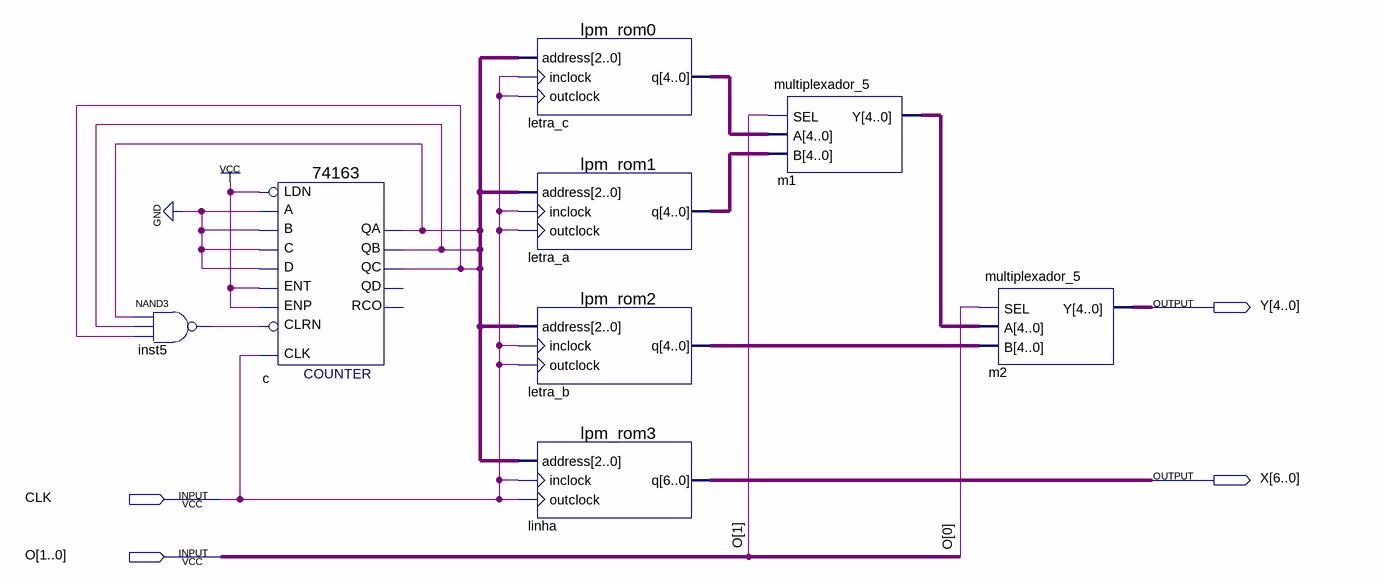
[diagram p0: schematic sheet]
// Quartus schematic matriz.bdf as structural Verilog: 8 symbols, 4 pins
module matriz (
  input  CLK,
  input  [1:0] O,
  output [4:0] Y,
  output [6:0] X
);

  wire inst5_out;
  wire [2:0] A;
  wire [4:0] letra_a_q, letra_b_q, letra_c_q, m1_y;

  nand inst5 (inst5_out, A[0], A[1], A[2]);
  \74163  c (
    .C(1'b0), .B(1'b0), .A(1'b0), .ENT(1'b1), .D(1'b0), .CLRN(inst5_out), .CLK(CLK), .ENP(1'b1), .LDN(1'b1),
    .QA(A[0]), .QB(A[1]), .QC(A[2]));  // open: QD, RCO
  lpm_rom0 letra_c (.address(A), .inclock(CLK), .outclock(CLK), .q(letra_c_q));
  lpm_rom1 letra_a (.address(A), .inclock(CLK), .outclock(CLK), .q(letra_a_q));
  lpm_rom2 letra_b (.address(A), .inclock(CLK), .outclock(CLK), .q(letra_b_q));
  lpm_rom3 linha (.address(A), .inclock(CLK), .outclock(CLK), .q(X));
  multiplexador_5 m1 (.SEL(O[1]), .A(letra_c_q), .B(letra_a_q), .Y(m1_y));
  multiplexador_5 m2 (.SEL(O[0]), .A(m1_y), .B(letra_b_q), .Y(Y));
endmodule
